# EAGLE schematic bms14921-v2 (EAGLE 4.13)
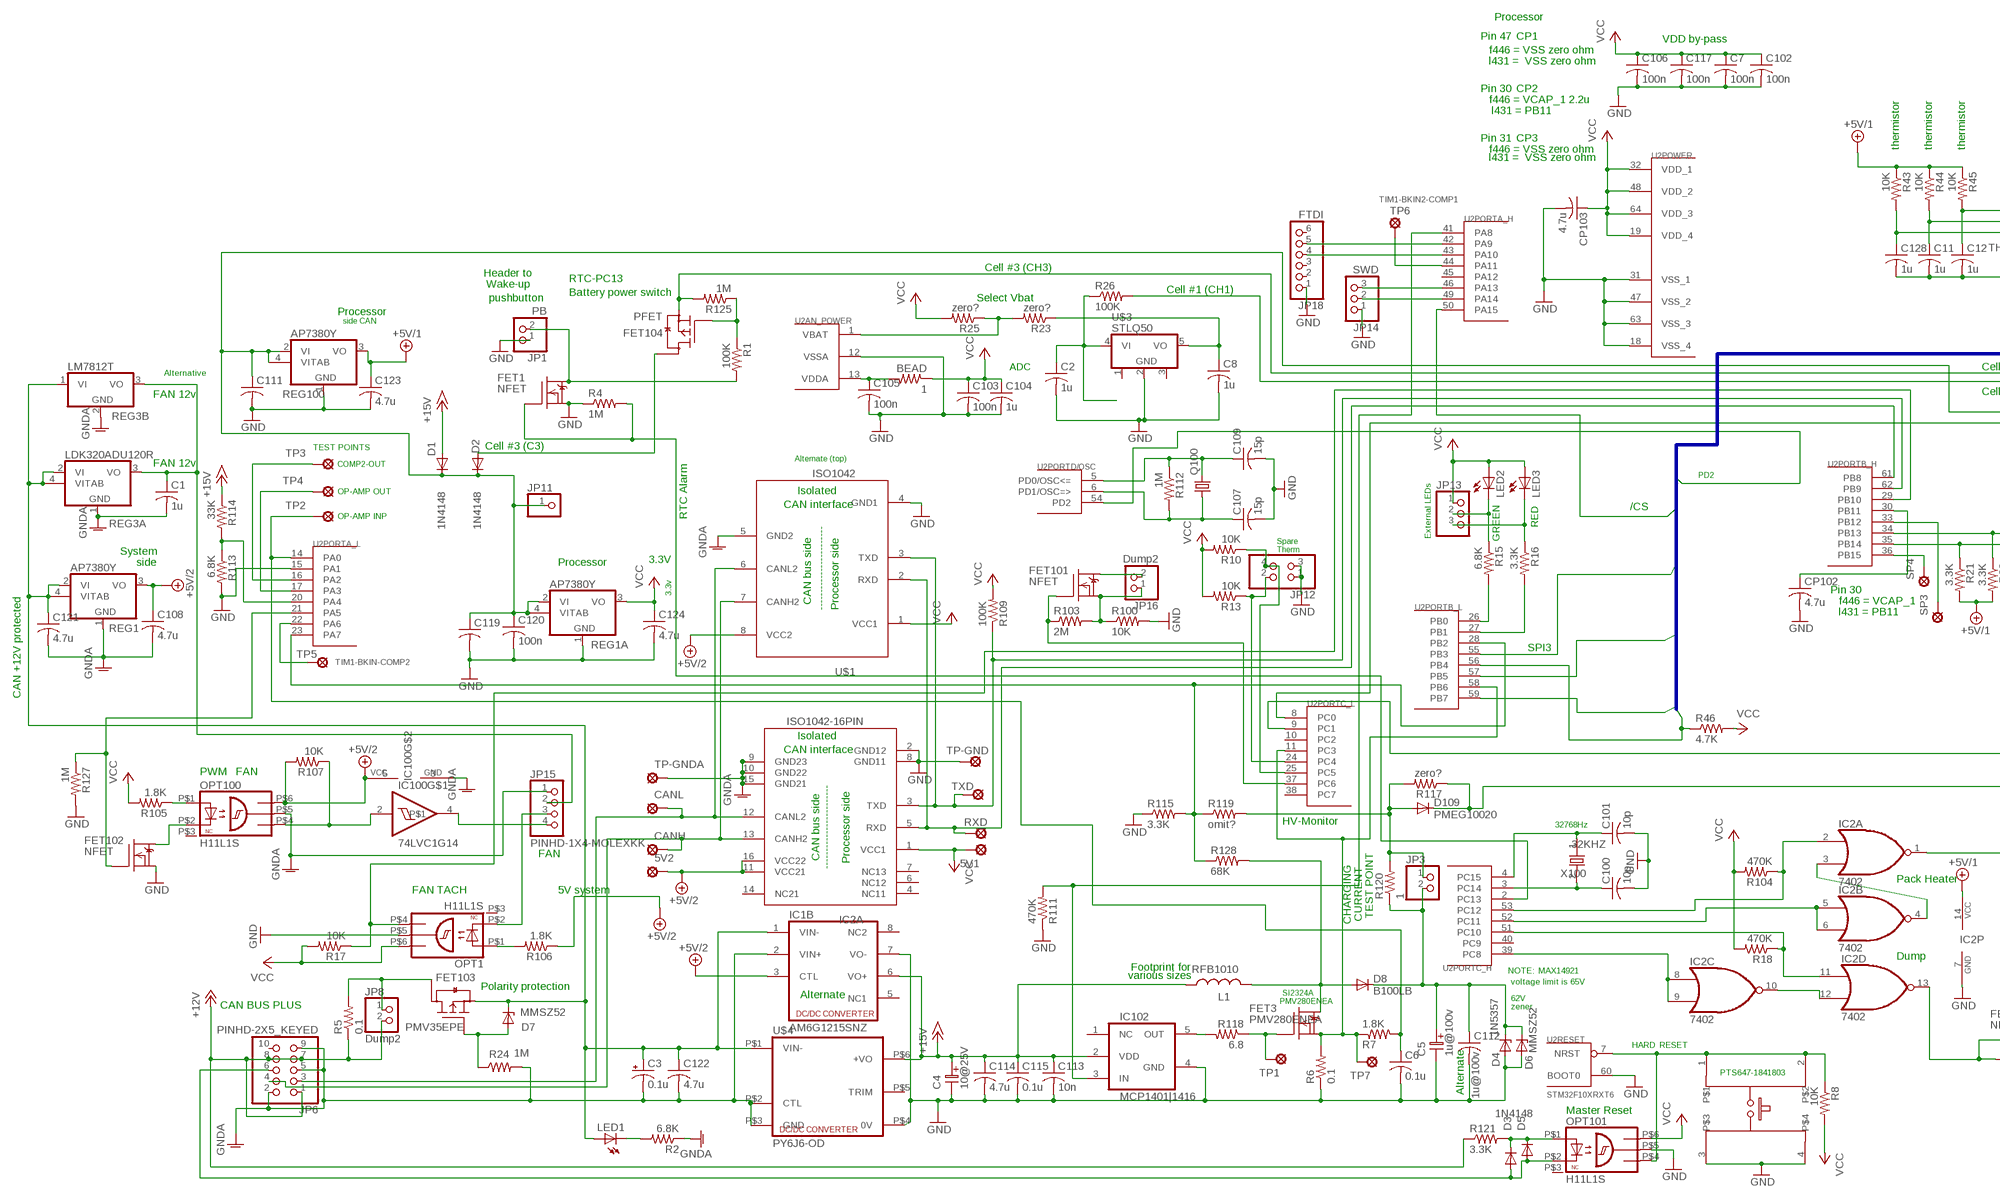
[diagram p0: schematic, sheet 1, part 1 of 2]
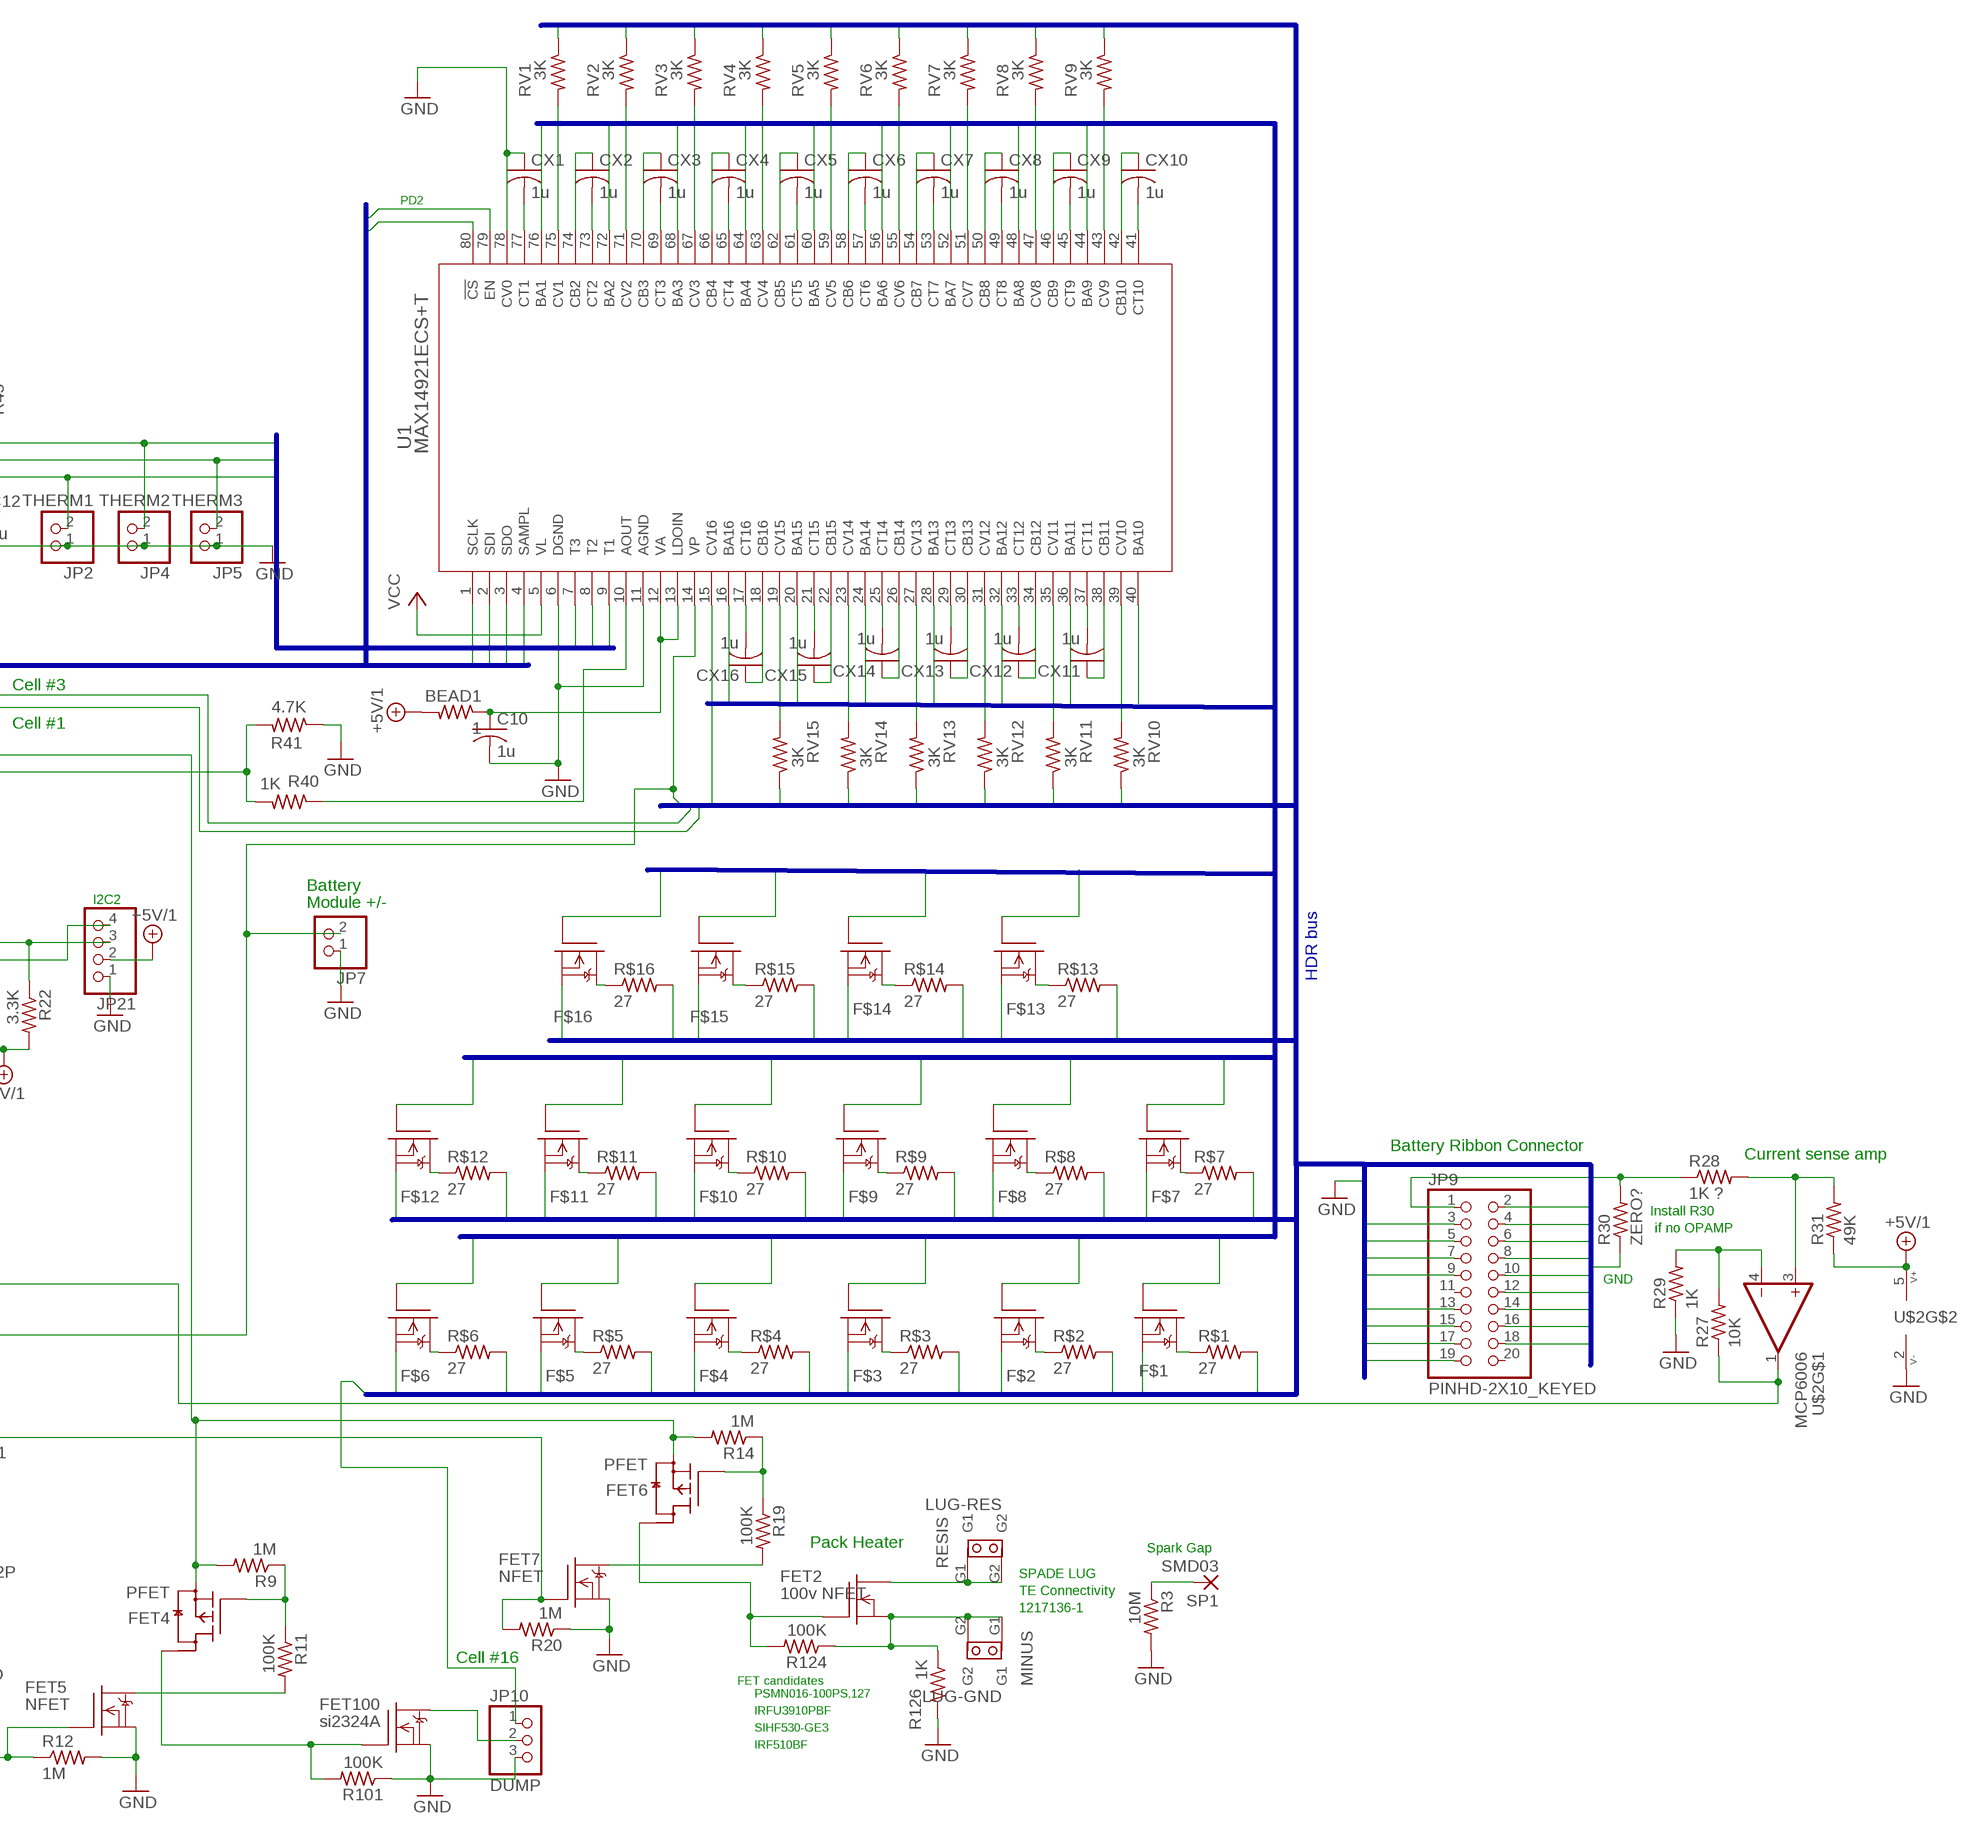
[diagram p1: schematic, sheet 1, part 2 of 2]

## Parts
5V1  SOLDPAD028  [SOLPAD028]
5V2  SOLDPAD028  [SOLPAD028]
32KHZ  X100  XTAL32KX32  [32KHZ]
BEAD  1  R-US_R0603  [R0603]
BEAD1  1  R-US_R0603  [R0603]
C1  1u  C-USC0603  [C0603]
C2  1u  C-USC0603  [C0603]
C3  0.1u  CPOL-USE5-8.5  [E5-8,5]
C4  10@25V  ELC-2,5L  [ES-2,5L]
C5  1u@100v  ELC-2,5L  [ES-2,5L]
C6  0.1u  C-USC0603  [C0603]
C7  100n  C-USC0603  [C0603]
C8  1u  C-USC0603  [C0603]
C10  1u  C-USC0603  [C0603]
C11  1u  C-USC0603  [C0603]
C12  1u  C-USC0603  [C0603]
C100  10p  C-USC0603  [C0603]
C101  10p  C-USC0603  [C0603]
C102  100n  C-USC0603  [C0603]
C103  100n  C-USC0603  [C0603]
C104  1u  C-USC0603  [C0603]
C105  100n  C-USC0603  [C0603]
C106  100n  C-USC0603  [C0603]
C107  15p  C-USC0603  [C0603]
C108  4.7u  C-USC0603  [C0603]
C109  15p  C-USC0603  [C0603]
C111  C-USC0805  [C0805]
C112  1u@100v  C-USC1206  [C1206]
C113  10n  C-USC0603  [C0603]
C114  4.7u  C-USC0805  [C0805]
C115  0.1u  C-USC0603  [C0603]
C117  100n  C-USC0603  [C0603]
C119  C-USC0805  [C0805]
C120  100n  C-USC0603  [C0603]
C121  4.7u  C-USC0805  [C0805]
C122  4.7u  C-USC0805  [C0805]
C123  4.7u  C-USC0603  [C0603]
C124  4.7u  C-USC0603  [C0603]
C128  1u  C-USC0603  [C0603]
CANH  SOLDPAD028  [SOLPAD028]
CANL  SOLDPAD028  [SOLPAD028]
CP102  4.7u  C-USC0603  [C0603]
CP103  4.7u  C-USC0603  [C0603]
CX1  1u  C-USC0603  [C0603]
CX2  1u  C-USC0603  [C0603]
CX3  1u  C-USC0603  [C0603]
CX4  1u  C-USC0603  [C0603]
CX5  1u  C-USC0603  [C0603]
CX6  1u  C-USC0603  [C0603]
CX7  1u  C-USC0603  [C0603]
CX8  1u  C-USC0603  [C0603]
CX9  1u  C-USC0603  [C0603]
CX10  1u  C-USC0603  [C0603]
CX11  1u  C-USC0603  [C0603]
CX12  1u  C-USC0603  [C0603]
CX13  1u  C-USC0603  [C0603]
CX14  1u  C-USC0603  [C0603]
CX15  1u  C-USC0603  [C0603]
CX16  1u  C-USC0603  [C0603]
D1  1N4148  1N4004_VERT  [DO41-10_VERT]
D2  1N4148  1N4004_VERT  [DO41-10_VERT]
D3  DIODE-SOD323-R  [SOD323-R]
D4  1N5357  ZENER-5W-VERT  [ZENER-VERT]
D5  1N4148  DIODE-SOD123  [SOD123]
D6  MMSZ52  ZENER-DIODESOD80C  [SOD80C]
D7  MMSZ52  ZENER-DIODESOD80C  [SOD80C]
D8  B100LB  [SMB_1]
D109  PMEG10020  PMEG10020PMEG10020-123W  [SOD123W]
F$1  DMN3404L  [SOT-23]
F$2  DMN3404L  [SOT-23]
F$3  DMN3404L  [SOT-23]
F$4  DMN3404L  [SOT-23]
F$5  DMN3404L  [SOT-23]
F$6  DMN3404L  [SOT-23]
F$7  DMN3404L  [SOT-23]
F$8  DMN3404L  [SOT-23]
F$9  DMN3404L  [SOT-23]
F$10  DMN3404L  [SOT-23]
F$11  DMN3404L  [SOT-23]
F$12  DMN3404L  [SOT-23]
F$13  DMN3404L  [SOT-23]
F$14  DMN3404L  [SOT-23]
F$15  DMN3404L  [SOT-23]
F$16  DMN3404L  [SOT-23]
FET1  NFET  DMN3404L  [SOT-23]
FET2  100v NFET  RFP30N06  [TO220V]
FET3  PMV280ENEA  DMN3404L  [SOT-23]
FET4  PFET  FET-P-SOT23  [SOT-23]
FET5  NFET  DMN3404L  [SOT-23]
FET6  PFET  FET-P-SOT23  [SOT-23]
FET7  NFET  DMN3404L  [SOT-23]
FET100  si2324A  DMN3404L  [SOT-23]
FET101  NFET  DMN3404L  [SOT-23]
FET102  NFET  DMN3404L  [SOT-23]
FET103  PMV35EPE  FET-P-SOT23  [SOT-23]
FET104  PFET  FET-P-SOT23  [SOT-23]
IC1B  AM6G1215SNZ  [DCDC7PINB]
IC2  7402  [TSSOP14]
IC2A  ISO1042-16PIN  [SO-16DW]
IC100  74LVC1G14  74LVC1G17  [SOT-23]
IC102  MCP1401|1416  MCP1416  [SOT23-5]
JP1  PB  PINHD-1X2  [1X02]
JP2  THERM1  PINHD-1X2  [1X02]
JP3  PINHD-1X2  [1X02]
JP4  THERM2  PINHD-1X2  [1X02]
JP5  THERM3  PINHD-1X2  [1X02]
JP6  PINHD-2X5_KEYED  [2X05_KEYED]
JP7  PINHD-1X2  [1X02]
JP8  Dump2  PINHD-1X2  [1X02]
JP9  PINHD-2X10_KEYED  [2X10_KEYED]
JP10  DUMP  PINHD-1X3  [1X03]
JP11  PINHD-1X1  [1X01]
JP12  PINHD-2X2  [2X02]
JP13  PINHD-1X3  [1X03]
JP14  SWD  PINHD-1X3  [1X03]
JP15  PINHD-1X4-MOLEXKK  [1X4-MOLEXKK]
JP16  Dump2  PINHD-1X2  [1X02]
JP18  FTDI  PINHD-1X6  [1X06]
JP21  PINHD-1X4  [1X04]
L1  RFB1010  [INDUCTOR6.0]
LED1  LEDCHIP-LED0603  [CHIP-LED0603]
LED2  LEDCHIP-LED0603  [CHIP-LED0603]
LED3  LEDCHIP-LED0603  [CHIP-LED0603]
LUG-GND  MINUS  SPADE-TAB  [SPADE_TAB]
LUG-RES  RESIS  SPADE-TAB  [SPADE_TAB]
OPT1  H11L1S  H!!LX  [SMD-6]
OPT100  H11L1S  H!!LX  [SMD-6]
OPT101  H11L1S  H!!LX  [SMD-6]
Q100  CRYTALHC49S  [HC49/S]
R1  100K  R-US_R0603  [R0603]
R2  6.8K  R-US_R0603  [R0603]
R3  10M  R-US_R0603  [R0603]
R4  1M  R-US_R0603  [R0603]
R5  0.1  R-US_R0805  [R0805]
R6  0.1  R-US_M1206  [M1206]
R7  1.8K  R-US_R0603  [R0603]
R8  10K  R-US_R0603  [R0603]
R9  1M  R-US_R0603  [R0603]
R10  10K  R-US_R0603  [R0603]
R11  100K  R-US_R0603  [R0603]
R12  1M  R-US_R0603  [R0603]
R13  10K  R-US_R0603  [R0603]
R14  1M  R-US_R0603  [R0603]
R15  6.8K  R-US_R0603  [R0603]
R16  3.3K  R-US_R0603  [R0603]
R17  10K  R-US_R0603  [R0603]
R18  470K  R-US_R0603  [R0603]
R19  100K  R-US_R0603  [R0603]
R20  1M  R-US_R0603  [R0603]
R21  3.3K  R-US_R0603  [R0603]
R22  3.3K  R-US_R0603  [R0603]
R23  zero?  R-US_R0603  [R0603]
R24  1M  R-US_R0603  [R0603]
R25  zero?  R-US_R0603  [R0603]
R26  100K  R-US_R0603  [R0603]
R27  10K  R-US_R0603  [R0603]
R28  1K ?  R-US_R0603  [R0603]
R29  1K  R-US_R0603  [R0603]
R30  ZERO?  R-US_R0603  [R0603]
R31  49K  R-US_R0603  [R0603]
R40  1K  R-US_R0603  [R0603]
R41  4.7K  R-US_R0603  [R0603]
R43  10K  R-US_R0603  [R0603]
R44  10K  R-US_R0603  [R0603]
R45  10K  R-US_R0603  [R0603]
R46  4.7K  R-US_R0603  [R0603]
R100  10K  R-US_R0603  [R0603]
R101  100K  R-US_R0603  [R0603]
R103  2M  R-US_R0603  [R0603]
R104  470K  R-US_R0603  [R0603]
R105  1.8K  R-US_R0603  [R0603]
R106  1.8K  R-US_R0603  [R0603]
R107  10K  R-US_R0603  [R0603]
R109  100K  R-US_R0603  [R0603]
R111  470K  R-US_R0603  [R0603]
R112  1M  R-US_R0603  [R0603]
R113  6.8K  R-US_R0603  [R0603]
R114  33K  R-US_R0603  [R0603]
R115  3.3K  R-US_R0603  [R0603]
R117  zero?  R-US_R0603  [R0603]
R118  6.8  R-US_R0603  [R0603]
R119  omit?  R-US_R0603  [R0603]
R120  1  R-US_R0603  [R0603]
R121  3.3K  R-US_R0603  [R0603]
R124  100K  R-US_R0603  [R0603]
R125  1M  R-US_R0603  [R0603]
R126  1K  R-US_R0603  [R0603]
R127  1M  R-US_R0603  [R0603]
R128  68K  R-US_R0603  [R0603]
R$1  27  R-US_0309/V  [0309V]
R$2  27  R-US_0309/V  [0309V]
R$3  27  R-US_0309/V  [0309V]
R$4  27  R-US_0309/V  [0309V]
R$5  27  R-US_0309/V  [0309V]
R$6  27  R-US_0309/V  [0309V]
R$7  27  R-US_0309/V  [0309V]
R$8  27  R-US_0309/V  [0309V]
R$9  27  R-US_0309/V  [0309V]
R$10  27  R-US_0309/V  [0309V]
R$11  27  R-US_0309/V  [0309V]
R$12  27  R-US_0309/V  [0309V]
R$13  27  R-US_0309/V  [0309V]
R$14  27  R-US_0309/V  [0309V]
R$15  27  R-US_0309/V  [0309V]
R$16  27  R-US_0309/V  [0309V]
REG1  AP7380Y  [SOT89]
REG1A  AP7380Y  [SOT89]
REG3A  LDK320ADU120R  AP7380Y  [SOT89]
REG3B  LM7812T  78  [TO220V]
REG100  AP7380Y  [SOT89]
RESET  RESET  E-SWITCH2  [E-SWITCH2]
RV1  3K  R-US_R0603  [R0603]
RV2  3K  R-US_R0603  [R0603]
RV3  3K  R-US_R0603  [R0603]
RV4  3K  R-US_R0603  [R0603]
RV5  3K  R-US_R0603  [R0603]
RV6  3K  R-US_R0603  [R0603]
RV7  3K  R-US_R0603  [R0603]
RV8  3K  R-US_R0603  [R0603]
RV9  3K  R-US_R0603  [R0603]
RV10  3K  R-US_R0603  [R0603]
RV11  3K  R-US_R0603  [R0603]
RV12  3K  R-US_R0603  [R0603]
RV13  3K  R-US_R0603  [R0603]
RV14  3K  R-US_R0603  [R0603]
RV15  3K  R-US_R0603  [R0603]
RXD  SOLDPAD028  [SOLPAD028]
SP1  SMD03  [SMD03]
SP3  SOLDPAD028  [SOLPAD028]
SP4  SOLDPAD028  [SOLPAD028]
TP1  SOLDPAD028  [SOLPAD028]
TP2  SOLDPAD0.6MM  [SOLPAD.6MM]
TP3  SOLDPAD0.6MM  [SOLPAD.6MM]
TP4  SOLDPAD0.6MM  [SOLPAD.6MM]
TP5  SOLDPAD0.6MM  [SOLPAD.6MM]
TP6  SOLDPAD0.6MM  [SOLPAD.6MM]
TP7  SOLDPAD028  [SOLPAD028]
TP-GND  SOLDPAD028  [SOLPAD028]
TP-GNDA  SOLDPAD028  [SOLPAD028]
TXD  SOLDPAD028  [SOLPAD028]
U1  MAX14921ECS+T  [21-0072F_MXM]
U2  STM32F10XRXT6  [TQFP64]
U$1  ISO1042  [SOIC-8]
U$2  MCP6006  [SC-70-5]
U$3  STLQ50  [SOT-323-5]
U$4  PY6J6-OD  [PYJ6-OD]

## Nets
12V-R: FET103.3(D) JP8.1 R5.2
+5V/1: BEAD1.2 C123.1 IC2.14(P:VCC) JP21.2 R21.2 R22.2 R31.1 R43.1 R44.1 R45.1 REG100.3(VO) U$2.5(V+)
+5V/2: 5V2.MP C108.1 IC1B.3(CTL) IC2A.11(VCC21) IC2A.16(VCC22) IC100.5(VCC) OPT100.P$6(VCC) R106.1 R107.2 REG1.3(VO) U$1.8(VCC2)
+12V: JP6.1 JP6.7 JP6.8 JP8.2 R5.1 R121.1
+15V: C4.1 C113.1 C114.1 C115.1 D1.A IC1B.6(VO+) IC102.2(VDD) L1.1 R114.1 U$4.P$6(+VO)
/CS: U1.80(!CS) U2.50(PORTA_H:PA15)
/PC10: IC2.3(A:I1) IC2.4(B:O)
AOUT: R40.1 U1.10(AOUT)
BA1: F$1.1(G) U1.76(BA1)
BA2: F$2.1(G) U1.72(BA2)
BA3: F$3.1(G) U1.68(BA3)
BA4: F$4.1(G) U1.64(BA4)
BA5: F$5.1(G) U1.60(BA5)
BA6: F$6.1(G) U1.56(BA6)
BA7: F$7.1(G) U1.52(BA7)
BA8: F$8.1(G) U1.48(BA8)
BA9: F$9.1(G) U1.44(BA9)
BA10: F$10.1(G) U1.40(BA10)
BA11: F$11.1(G) U1.36(BA11)
BA12: F$12.1(G) U1.32(BA12)
BA13: F$13.1(G) U1.28(BA13)
BA14: F$14.1(G) U1.24(BA14)
BA15: F$15.1(G) U1.20(BA15)
BA16: F$16.1(G) U1.16(BA16)
BATSW-NDRAIN: FET1.3(D) JP1.2 R1.2
BATSW-NDRAIN1: FET5.3(D) R11.2
BATSW-NDRAIN2: FET7.3(D) R19.2
BATSW-PGATE: FET104.1(G) R1.1 R125.1
BATSW-PGATE1: FET4.1(G) R9.1 R11.1
BATSW-PGATE2: FET6.1(G) R14.1 R19.1
BATTERY-MINUS-CURRENT-SENSE: JP9.1 R28.1 R30.2
BIGFET-DRAIN: FET2.2(D) LUG-RES.G1 LUG-RES.G2
BIGFET-GATE: FET2.1(G) FET6.3(D) R124.2
BIGFET-SOURCE: FET2.3(S) LUG-GND.G1 LUG-GND.G2 R124.1 R126.1
CAN+12PRO: C3.+ C121.1 C122.1 D7.C FET103.2(S) IC1B.1(VIN-) LED1.A REG1.2(VI) REG1.4(VITAB) REG3A.2(VI) REG3A.4(VITAB) REG3B.1(VI) U$4.P$1(VIN-)
CANH2: CANH.MP IC2A.13(CANH2) JP6.4 U$1.7(CANH2)
CANL2: CANL.MP IC2A.12(CANL2) JP6.3 U$1.6(CANL2)
CB2: CX2.1 U1.74(CB2)
CB3: CX3.1 U1.70(CB3)
CB4: CX4.1 U1.66(CB4)
CB5: CX5.1 U1.62(CB5)
CB6: CX6.1 U1.58(CB6)
CB7: CX7.1 U1.54(CB7)
CB8: CX8.1 U1.50(CB8)
CB9: CX9.1 U1.46(CB9)
CB10: CX10.1 U1.42(CB10)
CB11: CX11.1 U1.38(CB11)
CB12: CX12.1 U1.34(CB12)
CB13: CX13.1 U1.30(CB13)
CB14: CX14.1 U1.26(CB14)
CB15: CX15.1 U1.22(CB15)
CB16: CX16.1 U1.18(CB16)
CELL1-PFET-DRAIN: D2.A FET104.3(D)
CH1: F$2.2(S) JP9.12 R26.2 R$1.2 RV1.1
CH2: F$3.2(S) JP9.3 R$2.2 RV2.1
CH3: F$4.2(S) FET104.2(S) JP9.13 R125.2 R$3.2 RV3.1
CH4: F$5.2(S) JP9.4 R$4.2 RV4.1
CH5: F$6.2(S) JP9.14 R$5.2 RV5.1
CH6: F$7.2(S) JP9.5 R$6.2 RV6.1
CH7: F$8.2(S) JP9.15 R$7.2 RV7.1
CH8: F$9.2(S) JP9.6 R$8.2 RV8.1
CH9: F$10.2(S) JP9.16 R$9.2 RV9.1
CH10: F$11.2(S) JP9.7 R$10.2 RV10.1
CH11: F$12.2(S) JP9.17 R$11.2 RV11.1
CH12: F$13.2(S) JP9.8 R$12.2 RV12.1
CH13: F$14.2(S) JP9.18 R$13.2 RV13.1
CH14: F$15.2(S) JP9.9 R$14.2 RV14.1
CH15: F$16.2(S) JP9.19 R$15.2 RV15.1
CH16: D109.A(C) JP7.2 JP9.10 JP10.1 R117.1 R$16.2 U1.14(VP) U1.15(CV16)
CHGR-FET-DRAIN: D8.A FET3.3(D) L1.2 R128.2
CHGR-TEST-V+: D109.C(A) JP3.1 R117.2 R119.2 R120.2
CHGR-V+: C5.1 C112.1 D4.2(C) D6.C D8.C JP3.2 R120.1
CT1: CX1.2 U1.77(CT1)
CT2: CX2.2 U1.73(CT2)
CT3: CX3.2 U1.69(CT3)
CT4: CX4.2 U1.65(CT4)
CT5: CX5.2 U1.61(CT5)
CT6: CX6.2 U1.57(CT6)
CT7: CX7.2 U1.53(CT7)
CT8: CX8.2 U1.49(CT8)
CT9: CX9.2 U1.45(CT9)
CT10: CX10.2 U1.41(CT10)
CT11: CX11.2 U1.37(CT11)
CT12: CX12.2 U1.33(CT12)
CT13: CX13.2 U1.29(CT13)
CT14: CX14.2 U1.25(CT14)
CT15: CX15.2 U1.21(CT15)
CT16: CX16.2 U1.17(CT16)
CV1: RV1.2 U1.75(CV1)
CV2: RV2.2 U1.71(CV2)
CV3: RV3.2 U1.67(CV3)
CV4: RV4.2 U1.63(CV4)
CV5: RV5.2 U1.59(CV5)
CV6: RV6.2 U1.55(CV6)
CV7: RV7.2 U1.51(CV7)
CV8: RV8.2 U1.47(CV8)
CV9: RV9.2 U1.43(CV9)
CV10: RV10.2 U1.39(CV10)
CV11: RV11.2 U1.35(CV11)
CV12: RV12.2 U1.31(CV12)
CV13: RV13.2 U1.27(CV13)
CV14: RV14.2 U1.23(CV14)
CV15: RV15.2 U1.19(CV15)
DUMP2: FET101.3(D) JP16.2
DUMP2FET-SOURCE: FET101.2(S) JP16.1 R100.1 R103.2
DUMPFET-DRAIN: FET100.3(D) JP10.2
DUMPFET-GATE: FET4.3(D) FET100.1(G) R101.2
EN: U1.79(EN) U2.54(PORTD/OSC:PD2)
FAN+12: C1.1 JP15.2 REG3A.3(VO) REG3B.3(VO)
FANPWN: IC100.2(I) OPT100.P$4(OUT) R107.1
FANPWN-INVERT: IC100.4 JP15.4
FANTACH-H11DIODE: JP15.3 OPT1.P$2(C)
FANTACH-RESISTOR: OPT1.P$1(A) R106.2
FET103-GATE: D7.A FET103.1(G) R24.1
GATE-DRV-MCP1416: IC102.5(OUT) R118.2
GHR_FET_GATE: FET3.1(G) R118.1 TP1.MP
GND: C2.2 C4.2 C5.2 C6.2 C7.2 C8.2 C10.2 C11.2 C12.2 C100.2 C101.2 C102.2 C103.2 C104.2 C105.2 C106.2 C107.2 C109.2 C111.2 C112.2 C113.2 C114.2 C115.2 C117.2 C119.2 C120.2 C123.2 C124.2 C128.2 CP102.2 CP103.2 CX1.1 D4.1(A) D6.A F$1.2(S) FET1.2(S) FET5.2(S) FET7.2(S) FET100.2(S) FET102.2(S) IC1B.7(VO-) IC2.7(P:GND) IC2A.2(GND12) IC2A.8(GND11) IC102.4(GND) JP1.1 JP2.1 JP4.1 JP5.1 JP7.1 JP9.2 JP10.3 JP12.1 JP12.3 JP14.1 JP18.1 JP21.1 OPT1.P$5(GND) OPT101.P$5(GND) R3.2 R4.1 R6.1 R12.2 R20.1 R29.1 R30.1 R41.1 R100.2 R101.1 R111.1 R113.2 R115.1 R126.2 R127.2 REG1A.1(GND) REG100.1(GND) RESET.3 RESET.4 TP-GND.MP U1.6(DGND) U1.11(AGND) U1.78(CV0) U2.12(AN_POWER:VSSA) U2.15(PORTA_L:PA1) U2.18(POWER:VSS_4) U2.31(POWER:VSS_1) U2.47(POWER:VSS_2) U2.60(RESET:BOOT0) U2.63(POWER:VSS_3) U$1.4(GND1) U$2.2(V-) U$3.2(GND) U$4.P$4(0V)
GNDA: C1.2 C3.- C108.2 C121.2 C122.2 IC1B.2(VIN+) IC2A.9(GND23) IC2A.10(GND22) IC2A.15(GND21) IC100.3(GND) JP6.2 JP6.5 JP6.9 JP15.1 OPT100.P$5(GND) R2.1 R24.2 REG1.1(GND) REG3A.1(GND) REG3B.2(GND) TP-GNDA.MP U$1.5(GND2) U$4.P$2(CTL) U$4.P$3(GND)
H11L-PWM-R: OPT100.P$1(A) R105.1
H11PWM-FETDRV: FET102.3(D) OPT100.P$2(C)
K1: R3.1 SP1.1(P)
LED-EXT-GRN-CATHODE: JP13.2 LED2.C R15.1
LED-EXT-RED-CATHODE: JP13.3 LED3.C R16.1
LED_BUS_PWR: LED1.C R2.2
MASTER-RESET-RESISTOR: D3.C D5.C OPT101.P$1(A) R121.2
MASTER-RESET-SYS: D3.A D5.A JP6.6 OPT101.P$2(C)
MISO: R46.1 U1.3(SDO) U2.56(PORTB_L:PB4)
MOSI: U1.2(SDI) U2.57(PORTB_L:PB5)
N$1: F$13.3(D) R$13.1
N$2: F$14.3(D) R$14.1
N$3: F$15.3(D) R$15.1
N$4: F$16.3(D) R$16.1
N$5: F$1.3(D) R$1.1
N$6: F$2.3(D) R$2.1
N$7: F$3.3(D) R$3.1
N$8: F$4.3(D) R$4.1
N$9: F$5.3(D) R$5.1
N$10: F$6.3(D) R$6.1
N$11: F$7.3(D) R$7.1
N$12: F$8.3(D) R$8.1
N$13: F$9.3(D) R$9.1
N$14: F$10.3(D) R$10.1
N$15: F$11.3(D) R$11.1
N$16: F$12.3(D) R$12.1
NRST: OPT101.P$4(OUT) R8.1 RESET.1 RESET.2 U2.7(RESET:NRST)
OPA-VIN+: R28.2 R31.2 U$2.3(+IN)
OPA-VIN-: R27.2 R29.2 U$2.4(-IN)
PA0-OP-FILTERCURRENT: C6.1 R7.2 TP2.MP U2.14(PORTA_L:PA0)
PA2-COMP2-OUT: TP3.MP U2.16(PORTA_L:PA2)
PA3-OPAMP_INP: TP4.MP U2.17(PORTA_L:PA3)
PA4-15V-OR-DIVIDED-IN4: R113.1 R114.2 U2.20(PORTA_L:PA4)
PA5-FETGATE-FAN-PWM: FET102.1(G) R127.1 U2.21(PORTA_L:PA5)
PA6-T1-BKIN-COMP2: TP5.MP U2.22(PORTA_L:PA6)
PA8-T1C1-MCP1416_DRV: IC102.3(IN) R111.2 U2.41(PORTA_H:PA8)
PA9-USART1-TX: JP18.5 U2.42(PORTA_H:PA9)
PA10-USART1-RX: JP18.4 U2.43(PORTA_H:PA10)
PA13-SWDIO: JP14.3 U2.46(PORTA_H:PA13)
PA14-SWCLK: JP14.2 U2.49(PORTA_H:PA14)
PB0-LED-GRN: R15.2 U2.26(PORTB_L:PB0)
PB1-LED-RED: R16.2 U2.27(PORTB_L:PB1)
PB2-PA7-HV-DIV-COMP1_INP: R115.2 R119.1 R128.1 U2.23(PORTA_L:PA7) U2.28(PORTB_L:PB2)
PB6-PC3-COMP2_INP-CURRENT-SENSE: FET3.2(S) R6.2 R7.1 TP7.MP U2.11(PORTC_L:PC3) U2.58(PORTB_L:PB6)
PB8-CAN-RX: IC2A.5(RXD) RXD.MP U2.61(PORTB_H:PB8) U$1.2(RXD)
PB9-CAN-TX: IC2A.3(TXD) R109.1 TXD.MP U2.62(PORTB_H:PB9) U$1.3(TXD)
PB10-T2C3-FANTACH-H11L1OUT: OPT1.P$4(OUT) R17.1 U2.29(PORTB_H:PB10)
PB11-I2C2-SDA|VCAP1: CP102.1 U2.30(PORTB_H:PB11)
PB12-SPI2-NSS: SP3.MP U2.33(PORTB_H:PB12)
PB14-I2C2-SDA: JP21.4 R21.1 U2.35(PORTB_H:PB14)
PB-13-I2C2-SCK: JP21.3 R22.1 U2.34(PORTB_H:PB13)
PB-15: SP4.MP U2.36(PORTB_H:PB15)
PC0-AOUT-DIVIDED: R40.2 R41.2 U2.8(PORTC_L:PC0)
PC1-OPA: R27.1 U2.9(PORTC_L:PC1) U$2.1(OUT)
PC4: JP12.2 R13.1 U2.24(PORTC_L:PC4)
PC5: JP12.4 R10.1 U2.25(PORTC_L:PC5)
PC6-DUMPFET-GATE: FET101.1(G) R103.1 U2.37(PORTC_L:PC6)
PC8-/DUMP: IC2.8(C:I0) IC2.9(C:I1) U2.39(PORTC_H:PC8)
PC8-DUMP: IC2.10(C:O) IC2.12(D:I1)
PC10&/PC8-DUMP-FET-GATE: FET5.1(G) IC2.13(D:O) R12.1
PC10-DUMP: IC2.11(D:I0) R18.1 U2.51(PORTC_H:PC10)
PC11-/HEATER: IC2.5(B:I0) IC2.6(B:I1) U2.52(PORTC_H:PC11)
PC12-HEATER: IC2.2(A:I0) R104.1 U2.53(PORTC_H:PC12)
PC13-RTC-OUT: FET1.1(G) R4.2 U2.2(PORTC_H:PC13)
PC14_OSC32IN|XTAL: 32KHZ.2 C100.1 U2.3(PORTC_H:PC14)
PC15-32OSC-OUT: 32KHZ.1 C101.1 U2.4(PORTC_H:PC15)
PD0_OSC_IN_XTAL: C109.1 Q100.2 R112.1 U2.5(PORTD/OSC:PD0/OSC<=)
PD1_OSC_OUT: C107.1 Q100.1 R112.2 U2.6(PORTD/OSC:PD1/OSC=>)
SCLK: U1.1(SCLK) U2.55(PORTB_L:PB3)
SELECT: U1.4(SAMPL) U2.59(PORTB_L:PB7)
THRM1: C128.1 JP2.2 R43.2 U1.9(T1)
THRM2: C12.1 JP4.2 R45.2 U1.8(T2)
THRM3: C11.1 JP5.2 R44.2 U1.7(T3)
TIM1_BKIN2_COMP2: TP6.MP U2.44(PORTA_H:PA11)
V-ORED: C111.1 C119.1 C120.1 D1.C D2.C FET4.2(S) FET6.2(S) JP11.1 R9.2 R14.2 REG1A.2(VI) REG1A.4(VITAB) REG100.2(VI) REG100.4(VITAB)
VA_LDOIN: BEAD1.1 C10.1 U1.12(VA) U1.13(LDOIN)
VBAT: R23.2 R25.1 U2.1(AN_POWER:VBAT)
VBAT-REG-IN: C2.1 R26.1 U$3.4(VI)
VBAT-REG-OUT: C8.1 R23.1 U$3.5(VO)
VCC: 5V1.MP BEAD.1 C7.1 C102.1 C103.1 C104.1 C106.1 C117.1 C124.1 CP103.1 IC2A.1(VCC1) JP13.1 LED2.A LED3.A OPT1.P$6(VCC) OPT101.P$6(VCC) R8.2 R10.2 R13.2 R17.2 R18.2 R25.2 R46.2 R104.2 R105.2 R109.2 REG1A.3(VO) U1.5(VL) U2.19(POWER:VDD_4) U2.32(POWER:VDD_1) U2.48(POWER:VDD_2) U2.64(POWER:VDD_3) U$1.1(VCC1)
VDDA1: BEAD.2 C105.1 U2.13(AN_POWER:VDDA)
XOR-BIGFET-GATE: FET7.1(G) IC2.1(A:O) R20.2
Unconnected: IC1B.5(NC1) IC1B.8(NC2) IC2A.4(NC11) IC2A.6(NC12) IC2A.7(NC13) IC2A.14(NC21) IC102.1(NC) JP6.10 JP9.11 JP9.20 JP18.2 JP18.3 JP18.6 OPT1.P$3(NC) OPT100.P$3(NC) OPT101.P$3(NC) U2.10(PORTC_L:PC2) U2.38(PORTC_L:PC7) U2.40(PORTC_H:PC9) U2.45(PORTA_H:PA12) U$3.1(NC1) U$3.3(NC2) U$4.P$5(TRIM)

## Buses
HDR$:GND,CH[0..18]
SCLK,MOSI,MISO,SELECT,/CS,EN
B:BA[1..16]
TEMP:THRM[1..3]

## Notes on the sheet
- Processor
- Pin 47 | CP1 | VDD by-pass
- f446 = VSS zero ohm
- PD2
- l431 =  VSS zero ohm
- Pin 30 | CP2
- f446 = VCAP_1 2.2u
- l431 = PB11
- Pin 31 | CP3
- f446 = VSS zero ohm | thermistor | thermistor | thermistor
- l431 =  VSS zero ohm
- TIM1-BKIN2-COMP1
- V-ORED | 9-15v
- Cell #3 (CH3)
- Header to
- RTC-PC13
- Wake-up
- Battery power | switch | Cell #1 (CH1)
- pushbutton | Select Vbat
- Processor
- side CAN
- ADC | Cell #3
- Alternative
- FAN 12v | Cell #1
- Cell #3 (C3)
- TEST POINTS
- ~12v | Alternate (top)
- FAN 12v | COMP2-OUT
- PD2
- OP-AMP OUT | Isolated
- /CS | Battery
- CAN interface | I2C2 | Module +/-
- OP-AMP INP | RTC Alarm
- RED
- External LEDs
- GREEN
- Spare
- Therm
- System | HDR bus
- side | Processor | 3.3V
- 3.3v
- Pin 30
- CAN bus side | f446 = VCAP_1
- ------------------------ | Processor side
- l431 = PB11
- SPI3
- TIM1-BKIN-COMP2
- Battery Ribbon Connector
- Current sense amp
- CAN +12V protected
- Install R30
- if no OPAMP
- 9-15v
- V-ORED
- Isolated
- CAN interface | GND
- PWM | FAN
- HV-Monitor
- 32768Hz
- FAN
- CAN bus side | Processor side
- ------------------------
- Pack Heater
- FAN | TACH | 5V system
- CURRENT | TEST POINT
- CHARGING | Pack Heater
- Spark Gap
- SPADE LUG
- TE Connectivity
- Dump
- 1217136-1
- Footprint for
- NOTE: | MAX14921
- various sizes
- voltage limit is 65V
- Polarity protection
- SI2324A
- CAN BUS PLUS | Alternate | Cell #16
- 62V
- PMV280ENEA
- zener
- FET candidates
- PSMN016-100PS,127
- IRFU3910PBF
- SIHF530-GE3
- HARD | RESET
- IRF510BF
- PTS647-1841803
- Alternate
- Master Reset

## Library data of the parts
5V1 5V2 CANH CANL RXD SP3 SP4 TP1 TP7 TP-GND TP-GNDA TXD = solpad:SOLDPAD028
32KHZ = crystal:XTAL32K
BEAD BEAD1 R1-R31 R40 R41 R43-R46 R100 R101 R103-R107 R109 R111-R115 R117-R121 R124-R128 R$1-R$16 RV1-RV15 = rcl:R-US_: RESISTOR, American symbol
C1 C2 C6-C8 C10-C12 C100-C109 C111-C115 C117 C119-C124 C128 CP102 CP103 CX1-CX16 = rcl:C-US: CAPACITOR, American symbol
C3 = rcl:CPOL-US: POLARIZED CAPACITOR, American symbol
C4 C5 = DEH:ELC-2,5L
D1 D2 = diode:1N4004_VERT
D3 D5 = diode:DIODE-: DIODE
D4 = DEH:ZENER-5W-VERT
D6 D7 = diode-1:ZENER-DIODE: Z-Diode
D8 = diode-1:B100LB
D109 = diode-1:PMEG10020
F$1-F$16 FET1 FET3 FET5 FET7 FET100-FET102 = transistor-fet:DMN3404L
FET2 = transistor-fet:RFP30N06
FET4 FET6 FET103 FET104 = transistor-fet:FET-P-SOT23
IC1B = dc-dc-converter:AM6G1215SNZ
IC2 = 74xx-us:74*02: Quad 2-input NOR gate
IC2A = texas:ISO1042-16PIN
IC100 = 74xx-us:74LVC1G17
IC102 = DEH:MCP1416
JP1-JP5 JP7 JP8 JP16 = pinhead:PINHD-1X2: PIN HEADER
JP6 = pinhead:PINHD-2X5_KEYED
JP9 = pinhead:PINHD-2X10_KEYED
JP10 JP13 JP14 = pinhead:PINHD-1X3: PIN HEADER
JP11 = pinhead:PINHD-1X1: PIN HEADER
JP12 = pinhead:PINHD-2X2: PIN HEADER
JP15 = pinhead:PINHD-1X4-MOLEXKK
JP18 = pinhead:PINHD-1X6: PIN HEADER
JP21 = pinhead:PINHD-1X4: PIN HEADER
L1 = DEH:RFB1010
LED1-LED3 = led:LED: LED OSRAM: - CHIPLED LG R971, LG N971, LY N971, LG Q971, LY Q971, LO R971, LY R971 LH N974, LH R974 LS Q976, LO Q976, LY Q976 LO Q996 - Hyper CHIPLED LW Q18S LB Q993, LB Q99A, LB R99A - SideLED LS A670, LO A670, LY A670, LG A670, LP A670 LB A673, LV A673, LT A673, LW A673 LH A674 LY A675 LS A676, LA A676, LO A676, LY A676, LW A676 LS A679, LY A679, LG A679 - Hyper Micro SIDELED® LS Y876, LA Y876, LO Y876, LY Y876 LT Y87S - SmartLED LW L88C, LW L88S LB L89C, LB L89S, LG L890 LS L89K, LO L89K, LY L89K LS L896, LA L896, LO L896, LY L896 - TOPLED LS T670, LO T670, LY T670, LG T670, LP T670 LSG T670, LSP T670, LSY T670, LOP T670, LYG T670 LG T671, LOG T671, LSG T671 LB T673, LV T673, LT T673, LW T673 LH T674 LS T676, LA T676, LO T676, LY T676, LB T676, LH T676, LSB T676, LW T676 LB T67C, LV T67C, LT T67C, LS T67K, LO T67K, LY T67K, LW E67C LS E67B, LA E67B, LO E67B, LY E67B, LB E67C, LV E67C, LT E67C LW T67C LS T679, LY T679, LG T679 LS T770, LO T770, LY T770, LG T770, LP T770 LB T773, LV T773, LT T773, LW T773 LH T774 LS E675, LA E675, LY E675, LS T675 LS T776, LA T776, LO T776, LY T776, LB T776 LHGB T686 LT T68C, LB T68C - Hyper Mini TOPLED® LB M676 - Mini TOPLED Santana® LG M470 LS M47K, LO M47K, LY M47K Source: http://www.osram.convergy.de/
LUG-GND LUG-RES = DEH:SPADE-TAB
OPT1 OPT100 OPT101 = optocoupler:H!!LX
Q100 = crystal:CRYTAL: CRYSTAL
REG1 REG1A REG3A REG100 = linear:AP7380Y
REG3B = linear:78*: Positive VOLTAGE REGULATOR
RESET = switch-misc:E-SWITCH2
SP1 = wirepad:SMD03
TP2-TP6 = solpad:SOLDPAD0.6MM
U1 = maxim:MAX14921ECS+T
U2 = stm32:STM32F10XRXT6: STM32F101/103 64pin LQFP
U$1 = texas:ISO1042
U$2 = op-amp:MCP6006
U$3 = linear:STLQ50
U$4 = dc-dc-converter:PY6J6-OD